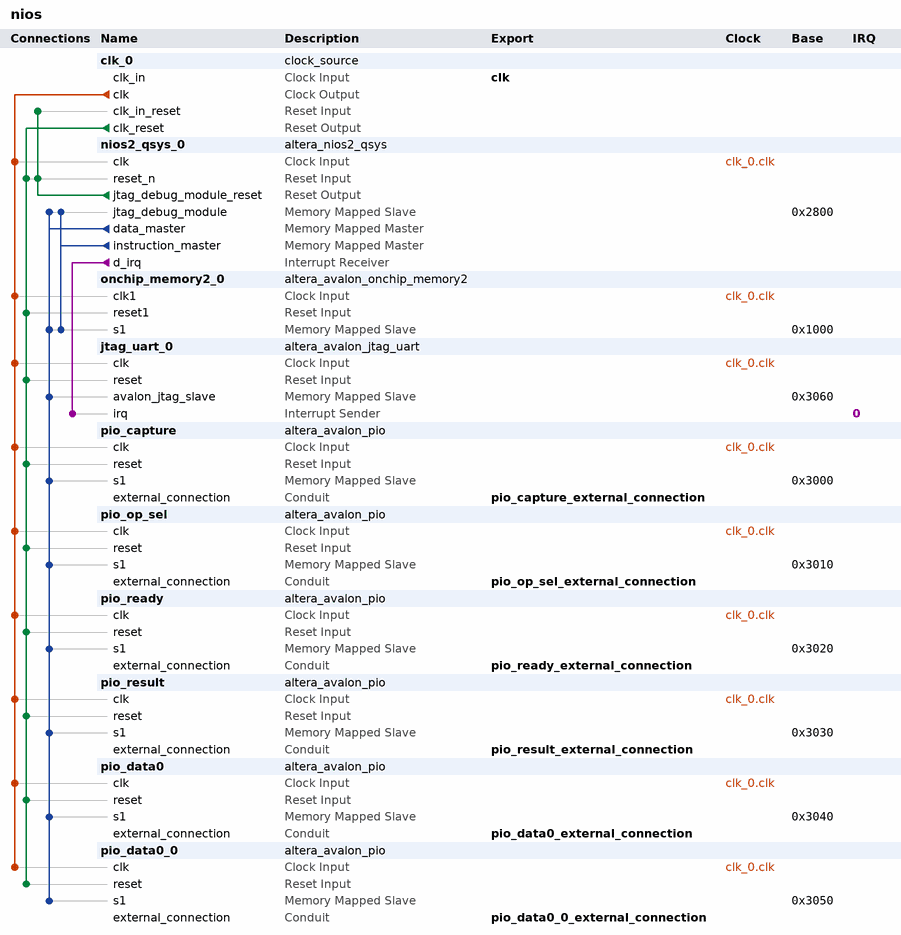
[diagram p0: system contents]
# Platform Designer (Qsys) system nios, Cyclone IV E Unknown
# Parameters at their usual value, and those the tool derives, are not listed.
package require -exact qsys 13.0.1.99.2
create_system nios
set_project_property DEVICE_FAMILY {Cyclone IV E}
set_project_property DEVICE Unknown

add_instance clk_0 clock_source 13.0
set_instance_parameter_value clk_0 clockFrequency 50000000

add_instance nios2_qsys_0 altera_nios2_qsys 13.0
set_instance_parameter_value nios2_qsys_0 resetSlave onchip_memory2_0.s1
set_instance_parameter_value nios2_qsys_0 mmu_TLBMissExcSlave None
set_instance_parameter_value nios2_qsys_0 exceptionSlave nios2_qsys_0.jtag_debug_module
set_instance_parameter_value nios2_qsys_0 breakSlave nios2_qsys_0.jtag_debug_module
set_instance_parameter_value nios2_qsys_0 impl Tiny
set_instance_parameter_value nios2_qsys_0 icache_size 4096

add_instance onchip_memory2_0 altera_avalon_onchip_memory2 13.0.1.99.2
set_instance_parameter_value onchip_memory2_0 dataWidth 32
set_instance_parameter_value onchip_memory2_0 dualPort false
set_instance_parameter_value onchip_memory2_0 initMemContent true
set_instance_parameter_value onchip_memory2_0 initializationFileName onchip_mem.hex
set_instance_parameter_value onchip_memory2_0 memorySize 4096

add_instance jtag_uart_0 altera_avalon_jtag_uart 13.0.1.99.2
set_instance_parameter_value jtag_uart_0 simInteractiveOptions NO_INTERACTIVE_WINDOWS

add_instance pio_capture altera_avalon_pio 13.0.1.99.2
set_instance_parameter_value pio_capture direction Output
set_instance_parameter_value pio_capture width 1

add_instance pio_op_sel altera_avalon_pio 13.0.1.99.2
set_instance_parameter_value pio_op_sel direction Output
set_instance_parameter_value pio_op_sel width 2

add_instance pio_ready altera_avalon_pio 13.0.1.99.2
set_instance_parameter_value pio_ready direction Input
set_instance_parameter_value pio_ready width 1

add_instance pio_result altera_avalon_pio 13.0.1.99.2
set_instance_parameter_value pio_result direction Input
set_instance_parameter_value pio_result width 9

add_instance pio_data0 altera_avalon_pio 13.0.1.99.2
set_instance_parameter_value pio_data0 direction Input
set_instance_parameter_value pio_data0 width 8

add_instance pio_data0_0 altera_avalon_pio 13.0.1.99.2
set_instance_parameter_value pio_data0_0 direction Input
set_instance_parameter_value pio_data0_0 width 8

# connections
add_connection clk_0.clk jtag_uart_0.clk clock
add_connection clk_0.clk nios2_qsys_0.clk clock
add_connection clk_0.clk onchip_memory2_0.clk1 clock
add_connection clk_0.clk pio_capture.clk clock
add_connection clk_0.clk pio_data0.clk clock
add_connection clk_0.clk pio_data0_0.clk clock
add_connection clk_0.clk pio_op_sel.clk clock
add_connection clk_0.clk pio_ready.clk clock
add_connection clk_0.clk pio_result.clk clock
add_connection clk_0.clk_reset jtag_uart_0.reset reset
add_connection clk_0.clk_reset nios2_qsys_0.reset_n reset
add_connection clk_0.clk_reset onchip_memory2_0.reset1 reset
add_connection clk_0.clk_reset pio_capture.reset reset
add_connection clk_0.clk_reset pio_data0.reset reset
add_connection clk_0.clk_reset pio_data0_0.reset reset
add_connection clk_0.clk_reset pio_op_sel.reset reset
add_connection clk_0.clk_reset pio_ready.reset reset
add_connection clk_0.clk_reset pio_result.reset reset
add_connection nios2_qsys_0.jtag_debug_module_reset clk_0.clk_in_reset reset
add_connection nios2_qsys_0.jtag_debug_module_reset nios2_qsys_0.reset_n reset
add_connection nios2_qsys_0.data_master jtag_uart_0.avalon_jtag_slave avalon
set_connection_parameter_value nios2_qsys_0.data_master/jtag_uart_0.avalon_jtag_slave baseAddress 0x3060
add_connection nios2_qsys_0.data_master nios2_qsys_0.jtag_debug_module avalon
set_connection_parameter_value nios2_qsys_0.data_master/nios2_qsys_0.jtag_debug_module baseAddress 0x2800
add_connection nios2_qsys_0.data_master onchip_memory2_0.s1 avalon
set_connection_parameter_value nios2_qsys_0.data_master/onchip_memory2_0.s1 baseAddress 0x1000
add_connection nios2_qsys_0.data_master pio_capture.s1 avalon
set_connection_parameter_value nios2_qsys_0.data_master/pio_capture.s1 baseAddress 0x3000
add_connection nios2_qsys_0.data_master pio_data0.s1 avalon
set_connection_parameter_value nios2_qsys_0.data_master/pio_data0.s1 baseAddress 0x3040
add_connection nios2_qsys_0.data_master pio_data0_0.s1 avalon
set_connection_parameter_value nios2_qsys_0.data_master/pio_data0_0.s1 baseAddress 0x3050
add_connection nios2_qsys_0.data_master pio_op_sel.s1 avalon
set_connection_parameter_value nios2_qsys_0.data_master/pio_op_sel.s1 baseAddress 0x3010
add_connection nios2_qsys_0.data_master pio_ready.s1 avalon
set_connection_parameter_value nios2_qsys_0.data_master/pio_ready.s1 baseAddress 0x3020
add_connection nios2_qsys_0.data_master pio_result.s1 avalon
set_connection_parameter_value nios2_qsys_0.data_master/pio_result.s1 baseAddress 0x3030
add_connection nios2_qsys_0.instruction_master nios2_qsys_0.jtag_debug_module avalon
set_connection_parameter_value nios2_qsys_0.instruction_master/nios2_qsys_0.jtag_debug_module baseAddress 0x2800
add_connection nios2_qsys_0.instruction_master onchip_memory2_0.s1 avalon
set_connection_parameter_value nios2_qsys_0.instruction_master/onchip_memory2_0.s1 baseAddress 0x1000
add_connection nios2_qsys_0.d_irq jtag_uart_0.irq interrupt
set_connection_parameter_value nios2_qsys_0.d_irq/jtag_uart_0.irq irqNumber 0

# exported interfaces
add_interface clk clock sink
set_interface_property clk EXPORT_OF clk_0.clk_in
add_interface pio_data0_0_external_connection conduit end
set_interface_property pio_data0_0_external_connection EXPORT_OF pio_data0_0.external_connection
add_interface pio_data0_external_connection conduit end
set_interface_property pio_data0_external_connection EXPORT_OF pio_data0.external_connection
add_interface pio_result_external_connection conduit end
set_interface_property pio_result_external_connection EXPORT_OF pio_result.external_connection
add_interface pio_ready_external_connection conduit end
set_interface_property pio_ready_external_connection EXPORT_OF pio_ready.external_connection
add_interface pio_op_sel_external_connection conduit end
set_interface_property pio_op_sel_external_connection EXPORT_OF pio_op_sel.external_connection
add_interface pio_capture_external_connection conduit end
set_interface_property pio_capture_external_connection EXPORT_OF pio_capture.external_connection

set_interconnect_requirement {$system} qsys_mm.clockCrossingAdapter HANDSHAKE
set_interconnect_requirement {$system} qsys_mm.maxAdditionalLatency 1

save_system nios.qsys
